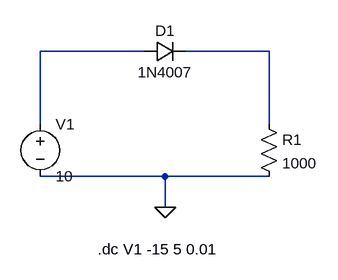
[diagram p0: schematic PN junction FB.asc]
PN junction FB.asc, the LTspice schematic file:
Version 4.1
SHEET 1 880 680
WIRE 112 -384 -48 -384
WIRE 304 -384 176 -384
WIRE -48 -272 -48 -384
WIRE 304 -272 304 -384
WIRE 144 -192 -48 -192
WIRE 304 -192 144 -192
WIRE 144 -144 144 -192
FLAG 144 -144 0
SYMBOL voltage -48 -288 R0
WINDOW 123 0 0 Left 0
WINDOW 39 0 0 Left 0
SYMATTR InstName V1
SYMATTR Value 10
SYMBOL res 288 -288 R0
SYMATTR InstName R1
SYMATTR Value 1000
SYMBOL diode 112 -368 R270
WINDOW 0 32 32 VTop 2
WINDOW 3 0 32 VBottom 2
SYMATTR InstName D1
SYMATTR Value 1N4007
TEXT 40 -80 Left 2 !.dc V1 -15 5 0.01

The netlist it stands for:
* PN junction FB.asc
V1 N001 0 10
R1 N002 0 1000
D1 N001 N002 1N4007
.model D D
.lib standard.dio
.dc V1 -15 5 0.01
.backanno
.end